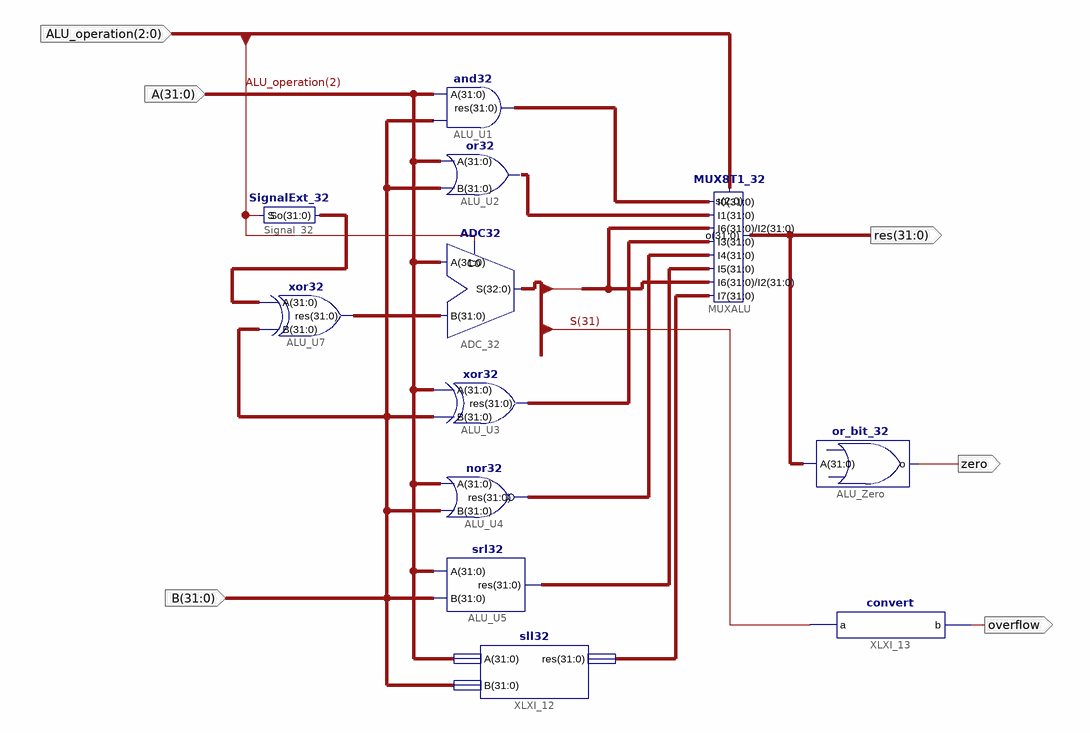
[diagram p0: schematic sheet 1]
// Xilinx ISE schematic ALU.sch (kintex7) as structural Verilog: 12 symbols, 6 ports
module ALU (
  input  [31:0] A,
  input  [31:0] B,
  input  [2:0] ALU_operation,
  output [31:0] res,
  output zero,
  output overflow
);

  wire [31:0] XLXN_17, XLXN_18, XLXN_24, XLXN_32, XLXN_40, XLXN_41, XLXN_42, XLXN_48;
  wire [32:0] S;

  and32 ALU_U1 (.res(XLXN_24), .A(A), .B(B));
  or32 ALU_U2 (.res(XLXN_32), .A(A), .B(B));
  ADC32 ADC_32 (.B(XLXN_17), .A(A), .C0(ALU_operation[2]), .S(S));
  xor32 ALU_U3 (.A(A), .B(B), .res(XLXN_40));
  nor32 ALU_U4 (.res(XLXN_41), .A(A), .B(B));
  srl32 ALU_U5 (.A(A), .B(B), .res(XLXN_42));
  SignalExt_32 Signal_32 (.So(XLXN_18), .S(ALU_operation[2]));
  xor32 ALU_U7 (.A(XLXN_18), .B(B), .res(XLXN_17));
  MUX8T1_32 MUXALU (
    .s(ALU_operation), .I7(XLXN_48), .I6(S[31:0]), .I5(XLXN_42), .I4(XLXN_41), .I3(XLXN_40), .I2(S[31:0]),
    .I1(XLXN_32), .I0(XLXN_24), .o(res));
  or_bit_32 ALU_Zero (.o(zero), .A(res));
  sll32 XLXI_12 (.A(A), .B(B), .res(XLXN_48));
  convert XLXI_13 (.a(S[31]), .b(overflow));
endmodule
